# Altium project EQF1248.PrjPcb
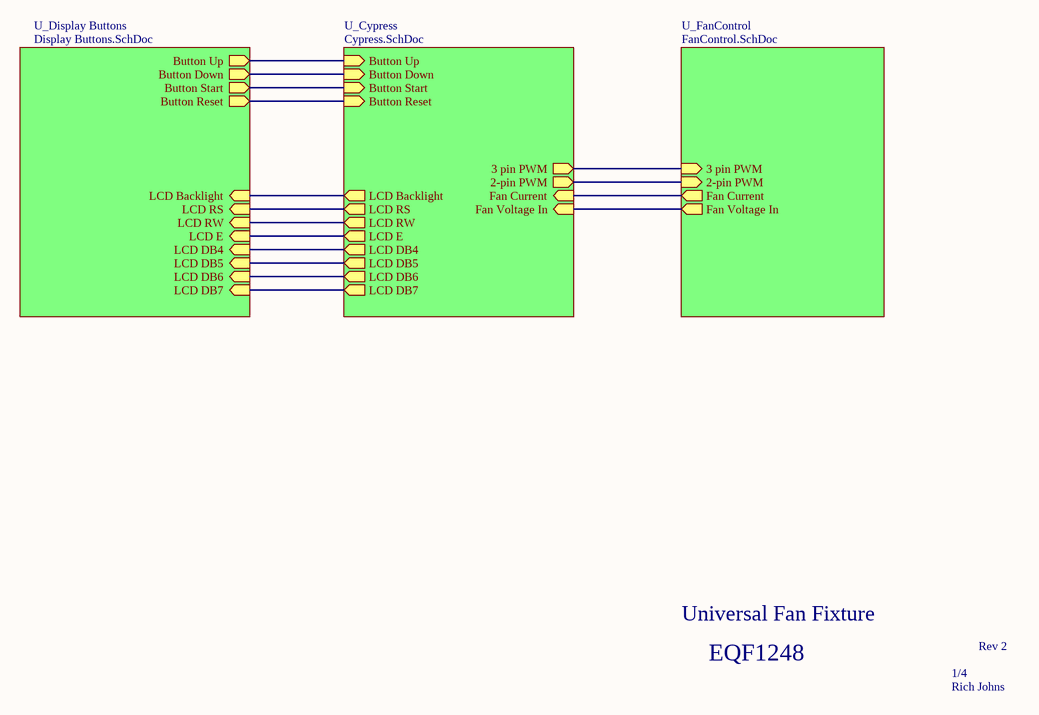
[diagram p0: Universal Fan Fixture.SchDoc]
4 sheets, 93 parts. Net scope: hierarchical (ports join the sheet entries above them; power ports are global).
Board file: EQF1248.PcbDoc
Sheets:
  Universal Fan Fixture.SchDoc
    U_Cypress = Cypress.SchDoc
    U_Display Buttons = Display Buttons.SchDoc
    U_FanControl = FanControl.SchDoc

## Sheet Universal Fan Fixture.SchDoc
size A; DocumentNumber: 1; SheetNumber: 1; SheetTotal: 4; PageSetup: Record=PageOptions|CenterHorizontal=True|CenterVertical=True|PrintScale=1.12|XCorrection=1.00|YCorrection=1.00|PrintKind=1|BorderSize=5000000|LeftOffset=0|BottomOffset=0|Orientation=2|PaperLength=2794|PaperWidth=2159|Scale=100|PaperSource=15|PrintQuality=600|MediaType=1|DitherType=10|PaperKind=Letter|PrintScaleMode=1

### Sub-sheets
U_Cypress = Cypress.SchDoc: LCD DB4 (out), LCD DB5 (out), LCD DB7 (out), LCD DB6 (out), LCD E (out), LCD RS (out), LCD RW (out), LCD Backlight (out), Button Down (in), Button Start (in), Button Up (in), Button Reset (in), 3 pin PWM (out), 2-pin PWM (out), Fan Current (in), Fan Voltage In (in)
U_Display Buttons = Display Buttons.SchDoc: Button Down (out), Button Start (out), Button Up (out), Button Reset (out), LCD Backlight (in), LCD RS (in), LCD RW (in), LCD E (in), LCD DB4 (in), LCD DB5 (in), LCD DB6 (in), LCD DB7 (in)
U_FanControl = FanControl.SchDoc: Fan Voltage In (out), Fan Current (out), 3 pin PWM (in), 2-pin PWM (in)

### Nets
NetR3_1: sheet U_Cypress/LCD RS, sheet U_Display Buttons/LCD RS
NetR4_1: sheet U_Cypress/LCD RW, sheet U_Display Buttons/LCD RW
NetR5_1: sheet U_Cypress/LCD E, sheet U_Display Buttons/LCD E
NetR6_1: sheet U_Cypress/LCD DB4, sheet U_Display Buttons/LCD DB4
NetR7_1: sheet U_Cypress/LCD DB5, sheet U_Display Buttons/LCD DB5
NetR8_1: sheet U_Cypress/LCD DB6, sheet U_Display Buttons/LCD DB6
NetR9_1: sheet U_Cypress/LCD DB7, sheet U_Display Buttons/LCD DB7
NetR11_1: sheet U_Cypress/LCD Backlight, sheet U_Display Buttons/LCD Backlight
NetR28_1: sheet U_Cypress/2-pin PWM, sheet U_FanControl/2-pin PWM
NetR30_1: sheet U_Cypress/Fan Current, sheet U_FanControl/Fan Current
NetR31_1: sheet U_Cypress/Button Reset, sheet U_Display Buttons/Button Reset
NetR32_1: sheet U_Cypress/Button Start, sheet U_Display Buttons/Button Start
NetR33_1: sheet U_Cypress/Button Down, sheet U_Display Buttons/Button Down
NetR34_1: sheet U_Cypress/Button Up, sheet U_Display Buttons/Button Up
NetU1_29: sheet U_Cypress/Fan Voltage In, sheet U_FanControl/Fan Voltage In
NetU1_30: sheet U_Cypress/3 pin PWM, sheet U_FanControl/3 pin PWM

### Notes on the sheet
- Universal Fan Fixture
- EQF1248
- 1/4
- Rev 2
- Rich Johns

## Sheet Cypress.SchDoc
size A; DocumentNumber: 2; SheetNumber: 2; SheetTotal: 4
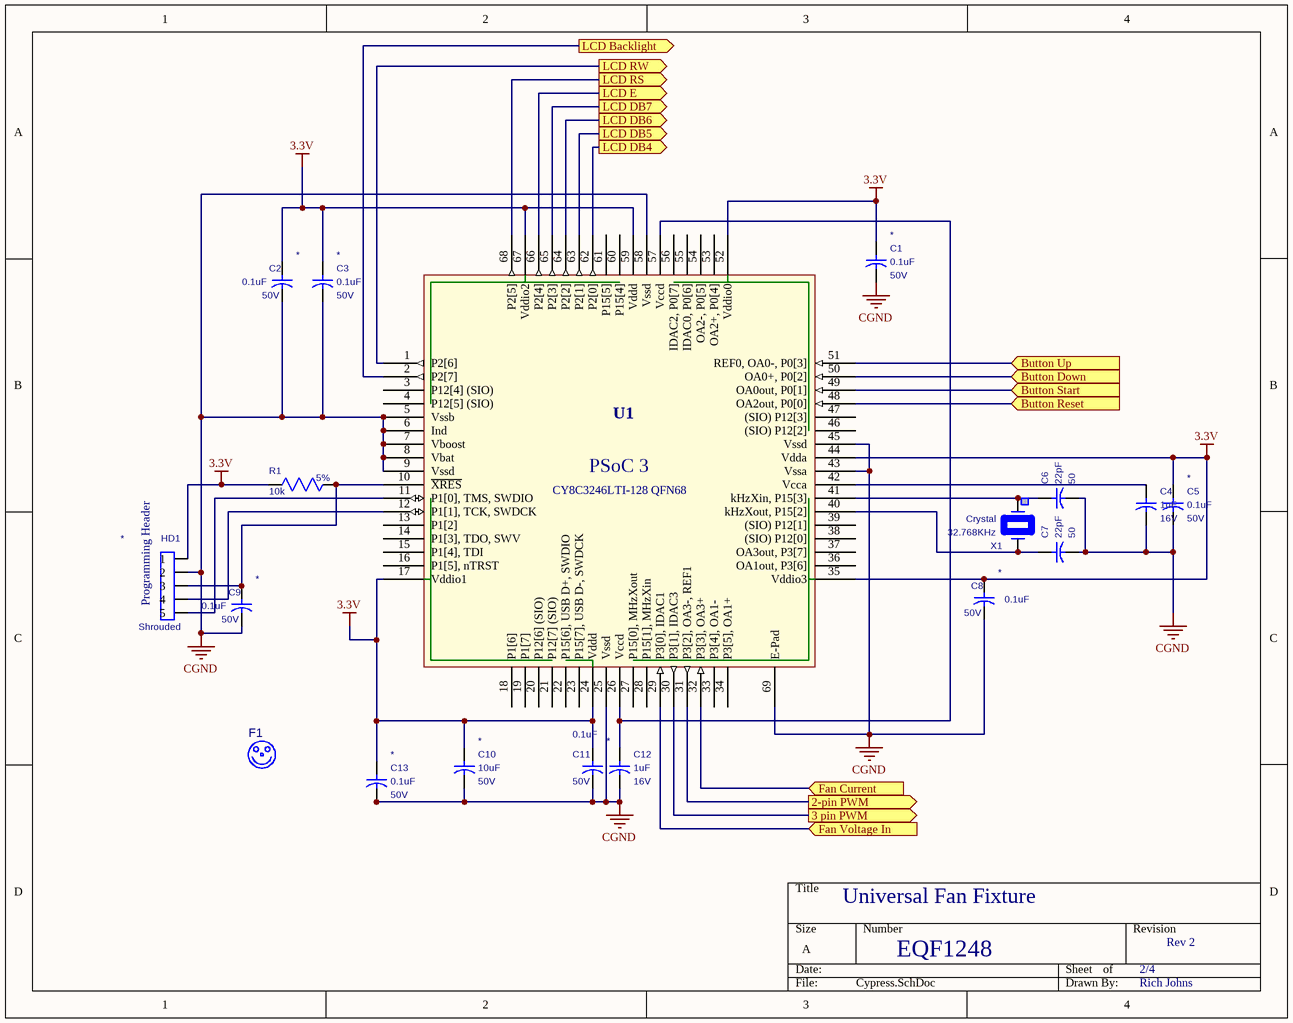
[diagram p1: Cypress.SchDoc]

### Parts
C1  value 0.1uF  Voltage: 50V  [0603]  (hidden comment: CAP_NON_POLAR_SMT)
C2  value 0.1uF  Voltage: 50V  [0603]  (hidden comment: CAP_NON_POLAR_SMT)
C3  value 0.1uF  Voltage: 50V  [0603]  (hidden comment: CAP_NON_POLAR_SMT)
C4  value 1uF  Voltage: 16V  [0603]  (hidden comment: 1.0uF_0603_16V)
C5  value 0.1uF  Voltage: 50V  [0603]  (hidden comment: CAP_NON_POLAR_SMT)
C6  value 22pF  Voltage: 50  [0603]  (hidden comment: 22pF_0603)
C7  value 22pF  Voltage: 50  [0603]  (hidden comment: 22pF_0603)
C8  value 0.1uF  Voltage: 50V  [0603]  (hidden comment: CAP_NON_POLAR_SMT)
C9  value 0.1uF  Voltage: 50V  [0603]  (hidden comment: CAP_NON_POLAR_SMT)
C10  value 10uF  Voltage: 50V  [1206]  (hidden comment: CAP_NON_POLAR_SMT)
C11  value 0.1uF  Voltage: 50V  [0603]  (hidden comment: CAP_NON_POLAR_SMT)
C12  value 1uF  Voltage: 16V  [0603]  (hidden comment: 1.0uF_0603_16V)
C13  value 0.1uF  Voltage: 50V  [0603]  (hidden comment: CAP_NON_POLAR_SMT)
F1  FIDUCIAL_SMILEY  [FIDUCIAL_SMILEY]  (value not drawn)
HD1  HeaderType: Shrouded  [HDR5PIN100SHRD]  (hidden comment: HDR5PIN100SHRD)
R1  value 10k  Tolerance: 5%  [RC0603REFLOW-IPC]  (hidden comment: R0603REFLOW_5%_1/8WATT)
U1  CY8C3246LTI-128 QFN68  [QFN68_8x8-MD]
X1  Frequency: 32.768KHz  XtalType: Crystal  [.03_Small_Footprint_CRYSTAL]  (hidden comment: 32.768KHZ_CRYSTAL)

### Ports
2-pin PWM (out), 3 pin PWM (out), Button Down (in), Button Reset (in), Button Start (in), Button Up (in), Fan Current (in), Fan Voltage In (in), LCD Backlight (out), LCD DB4 (out), LCD DB5 (out), LCD DB6 (out), LCD DB7 (out), LCD E (out), LCD RS (out), LCD RW (out)

### Nets
3.3V: C1.1(pin1) C2.1(pin1) C3.1(pin1) C5.1(pin1) C8.1(pin1) C10.1(pin1) C11.1(pin1) C13.1(pin1) HD1.1 R1.2(pin2) U1.17(Vddio1) U1.24(Vddd) U1.35(Vddio3) U1.44(Vdda) U1.52(Vddio0) U1.59(Vddd) U1.67(Vddio2)
CGND: C1.2(pin2) C2.2(pin2) C3.2(pin2) C4.2(pin2) C5.2(pin2) C6.2(pin2) C7.2(pin2) C8.2(pin2) C9.2(pin2) C10.2(pin2) C11.2(pin2) C12.2(pin2) C13.2(pin2) HD1.2 U1.5(Vssb) U1.6(Ind) U1.7(Vboost) U1.8(Vbat) U1.9(Vssd) U1.25(Vssd) U1.43(Vssa) U1.45(Vssd) U1.58(Vssd) U1.69(E-Pad)
NetC4_1: C4.1(pin1) U1.42(Vcca)
NetC6_1: C6.1(pin1) U1.41(kHzXin,_P15[3]) X1.1
NetC7_1: C7.1(pin1) U1.40(kHzXout,_P15[2]) X1.2
NetC9_1: C9.1(pin1) HD1.3 R1.1(pin1) U1.10(~{XRES})
NetC12_1: C12.1(pin1) U1.26(Vccd) U1.57(Vccd)
NetHD1_4: HD1.4 U1.12(P1[1],_TCK,_SWDCK)
NetHD1_5: HD1.5 U1.11(P1[0],_TMS,_SWDIO)
NetR3_1: U1.68(P2[5]) ; port LCD RS
NetR4_1: U1.1(P2[6]) ; port LCD RW
NetR5_1: U1.66(P2[4]) ; port LCD E
NetR6_1: U1.62(P2[0]) ; port LCD DB4
NetR7_1: U1.63(P2[1]) ; port LCD DB5
NetR8_1: U1.64(P2[2]) ; port LCD DB6
NetR9_1: U1.65(P2[3]) ; port LCD DB7
NetR11_1: U1.2(P2[7]) ; port LCD Backlight
NetR28_1: U1.31(P3[2],_OA3-,_REF1) ; port 2-pin PWM
NetR30_1: U1.32(P3[3],_OA3+) ; port Fan Current
NetR31_1: U1.48(OA2out,_P0[0]) ; port Button Reset
NetR32_1: U1.49(OA0out,_P0[1]) ; port Button Start
NetR33_1: U1.50(OA0+,_P0[2]) ; port Button Down
NetR34_1: U1.51(REF0,_OA0-,_P0[3]) ; port Button Up
NetU1_29: U1.29(P3[0],_IDAC1) ; port Fan Voltage In
NetU1_30: U1.30(P3[1],_IDAC3) ; port 3 pin PWM

Not connected (* = marked no-connect by the designer): HD1 6; U1 3(P12[4]_(SIO)) 4(P12[5]_(SIO)) 13(P1[2]) 14(P1[3],_TDO,_SWV) 15(P1[4],_TDI) 16(P1[5],_nTRST) 18(P1[6]) 19(P1[7]) 20(P12[6]_(SIO)) 21(P12[7]_(SIO)) 22(P15[6],_USB_D+,_SWDIO) 23(P15[7],_USB_D-,_SWDCK) 27(P15[0],_MHzXout) 28(P15[1],_MHzXin) 33(P3[4],_OA1-) 34(P3[5],_OA1+) 36(OA1out,_P3[6]) 37(OA3out,_P3[7]) 38((SIO)_P12[0]) 39((SIO)_P12[1]) 46((SIO)_P12[2]) 47((SIO)_P12[3]) 53(OA2+,_P0[4]) 54(OA2-,_P0[5]) 55(IDAC0,_P0[6]) 56(IDAC2,_P0[7]) 60(P15[4]) 61(P15[5])

### Notes on the sheet
- (near HD1) Programming Header
- Universal Fan Fixture
- EQF1248
- 2/4
- Rev 2
- Rich Johns
- (in symbol CY8C3xxxLTx-xxx QFN68) PSoC 3

### Library data of the parts
C1-C3 C5 C8 C9 C11 C13 = 264790: Capacitor, 0.1uF, 50V, Ceramic, X7R, +/- 20%, Non-Polar, 0603, Kemet: C0603C104M5RACTU or equivalent; plIDX: 264790; Tolerance: +/- 20%; CheckedBy: Sam Rhoufiry; DNS: *; ComponentType: Capacitor; CreatedBy: Mike Tyger; LastUpdatedBy: Mike Tyger; Cost: 0.01; Composition: Ceramic; CapType: X7R; Polarity: Non-Polar; Package: 0603; Vendor: Kemet: C0603C104M5RACTU or equivalent; ComponentLink4URL: https://pdm.iconfitness.com/PDM/EBOM/PartsMaintenance/PartsMaintenance.aspx?Editplidx=264790; ComponentLink4Description: PDM Parts Maintenance
C4 C12 = 18838: Capacitor, 1uF, 16V, Ceramic, X5R, +/- 10%, Non-Polar, 0603, 2, MURATA: GRM188R61C105KA93D OR EQUIVALENT; Tolerance: +/- 10%; plIDX: 18838; Composition: Ceramic; Package: 0603; CapType: X5R; Polarity: Non-Polar; Vendor: MURATA: GRM188R61C105KA93D OR EQUIVALENT; CheckedBy: gdeguzman; ModifyDate: 3/9/10; ComponentType: Capacitor; Supplier 1: Digi-Key; Supplier Part Number 1: 490-1536-2-ND; LastUpdatedBy: Rui Zhang; Cost: 0.001; Pins: 2; ComponentLink4URL: https://pdm.iconfitness.com/PDM/EBOM/PartsMaintenance/PartsMaintenance.aspx?Editplidx=18838; ComponentLink4Description: PDM Parts Maintenance
C6 C7 = 19574: Capacitor, 22pF, 50, Ceramic, NPO, +/-5%, Non-Polar, 0603, 2, Kemet:C0603C220J5GACTU or equivalent; plIDX: 19574; Composition: Ceramic; Package: 0603; CapType: NPO; Tolerance: +/-5%; Polarity: Non-Polar; Vendor: Kemet:C0603C220J5GACTU or equivalent; CheckedBy: gdeguzman; ModifyDate: 4/23/10; ComponentType: Capacitor; Supplier 1: Digi-Key; Supplier Part Number 1: 399-1053-2-ND; LastUpdatedBy: Michael Angeli; Cost: 0.01; Pins: 2; ComponentLink4URL: https://pdm.iconfitness.com/PDM/EBOM/PartsMaintenance/PartsMaintenance.aspx?Editplidx=19574; ComponentLink4Description: PDM Parts Maintenance
C10 = 265299: Capacitor, 10uF, 50V, Ceramic, X5R, +/- 20%, Non-Polar, 1206, Taiyo Yuden: UMK316BBJ106ML-T or equivalent; plIDX: 265299; Tolerance: +/- 20%; CheckedBy: Sam Rhoufiry; DNS: *; ComponentType: Capacitor; CreatedBy: Mike Tyger; LastUpdatedBy: Mike Tyger; Cost: 0.05; Composition: Ceramic; CapType: X5R; Polarity: Non-Polar; Package: 1206; Vendor: Taiyo Yuden: UMK316BBJ106ML-T or equivalent; ComponentLink1URL: http://www.yuden.co.jp/productdata/catalog/en/mlcc01_e.pdf; ComponentLink1Description: Datasheet; ComponentLink4URL: https://pdm.iconfitness.com/PDM/EBOM/PartsMaintenance/PartsMaintenance.aspx?Editplidx=265299; ComponentLink4Description: PDM Parts Maintenance
F1 = 264290: Fiducial, Smiley, PCB reference point, not a component; plIDX: 264290; Value: Smiley; ComponentType: Fiducial; CreatedBy: Mike Tyger; LastUpdatedBy: Michael Angeli; Cost: 0; Vendor: PCB reference point, not a component; ComponentLink4URL: https://pdm.iconfitness.com/PDM/EBOM/PartsMaintenance/PartsMaintenance.aspx?Editplidx=264290; ComponentLink4Description: PDM Parts Maintenance
HD1 = 1770: Header, 0.100 in., 5 pin Pins, Shrouded, AMP: 644486-5; IDF_COMP: 1; plIDX: 1770; LeadSpacing: 0.100 in.; Pins: 5 pin; Vendor: AMP: 644486-5; CheckedBy: Michael Angeli; Datasheet: g:\accel_lib\datasheets\MTA-AMP.pdf; ModifyDate: 07/30/2008 17:40:27; ComponentHeight: 625mil; ComponentType: Header; DNS: *; Cost: 0.08; ComponentLink4URL: https://pdm.iconfitness.com/PDM/EBOM/PartsMaintenance/PartsMaintenance.aspx?Editplidx=1770; ComponentLink4Description: PDM Parts Maintenance
R1 = 15593: Resistor, 18, ThickFilm, 5%, 0603, 1/8W, Any; plIDX: 15593; DNS: *; Wattage: 1/8W; Composition: ThickFilm; Package: 0603; Vendor: Any; CheckedBy: *; ModifyDate: 05/30/2007 09:48:36; ComponentType: Resistor; Cost: 0.001; ComponentLink4URL: https://pdm.iconfitness.com/PDM/EBOM/PartsMaintenance/PartsMaintenance.aspx?Editplidx=15593; ComponentLink4Description: PDM Parts Maintenance
U1 = CY8C3xxxLTx-xxx QFN68: CY8C3xxxLTx-xxx 68 pin QFN; MFN: Cypress Semiconductor; MFG: Cypress; MFGPN: CY8C3xxxLTx-xxx; Vendor: Cypress; VPN: CY8C3246LTI-128
X1 = 19127: Xtal, 0.7 mm, Cylinder, 2, Crystal, 32.768KHz, ECS: ECS-.327-12.5-13;Alternates require approval; LeadSpacing: 0.7 mm; plIDX: 19127; CheckedBy: Sam Rhoufiry; Package: Cylinder; Pins: 2; Vendor: ECS: ECS-.327-12.5-13;Alternates require approval; Datasheet: G:\accel_lib\datasheets\Crystal_32768KHz_ECS-3x8.pdf; ModifyDate: 4/16/10; ComponentType: Xtal; DNS: *; Cost: 0.0945; ComponentLink4URL: https://pdm.iconfitness.com/PDM/EBOM/PartsMaintenance/PartsMaintenance.aspx?Editplidx=19127; ComponentLink4Description: PDM Parts Maintenance

## Sheet Display Buttons.SchDoc
size A; DocumentNumber: 4; SheetNumber: 4; SheetTotal: 4
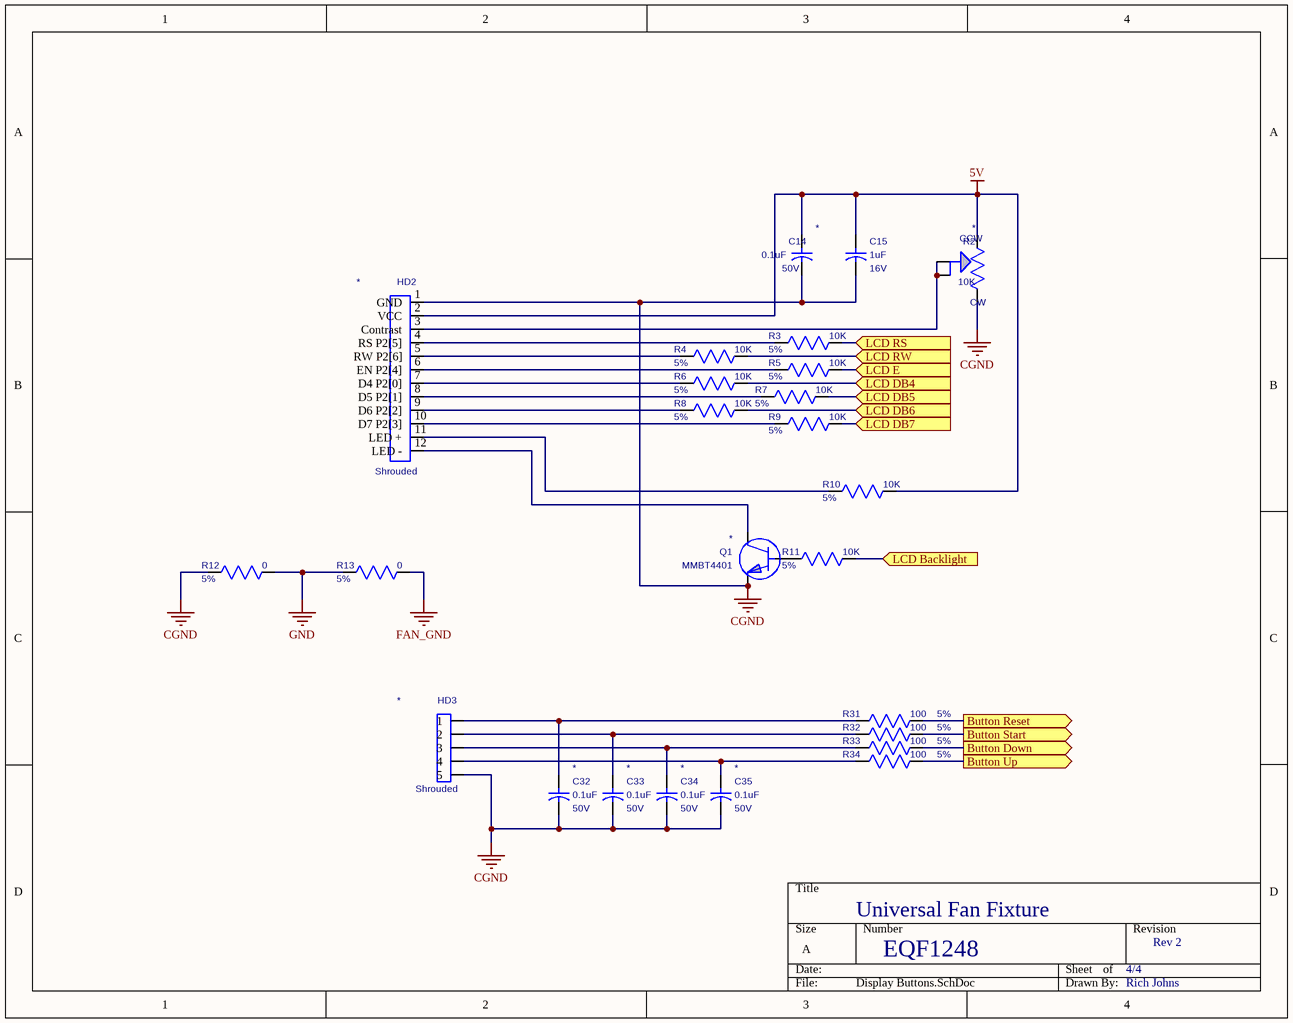
[diagram p2: Display Buttons.SchDoc]

### Parts
C14  value 0.1uF  Voltage: 50V  [0603]  (hidden comment: CAP_NON_POLAR_SMT)
C15  value 1uF  Voltage: 16V  [0603]  (hidden comment: 1.0uF_0603_16V)
C32  value 0.1uF  Voltage: 50V  [0603]  (hidden comment: CAP_NON_POLAR_SMT)
C33  value 0.1uF  Voltage: 50V  [0603]  (hidden comment: CAP_NON_POLAR_SMT)
C34  value 0.1uF  Voltage: 50V  [0603]  (hidden comment: CAP_NON_POLAR_SMT)
C35  value 0.1uF  Voltage: 50V  [0603]  (hidden comment: CAP_NON_POLAR_SMT)
HD2  HeaderType: Shrouded  [HDR12PIN100SHRD]  (hidden comment: HDR12PIN100SHRD)
HD3  HeaderType: Shrouded  [HDR5PIN100SHRD]  (hidden comment: HDR5PIN100SHRD)
Q1  value MMBT4401  [SOT23-3]  (hidden comment: NPN_TRANSISTOR)
R2  value 10K  [6MM POT]  (hidden comment: POT 6MM 10K)
R3  value 10K  Tolerance: 5%  [0603]  (hidden comment: Resistor_0603_5%)
R4  value 10K  Tolerance: 5%  [0603]  (hidden comment: Resistor_0603_5%)
R5  value 10K  Tolerance: 5%  [0603]  (hidden comment: Resistor_0603_5%)
R6  value 10K  Tolerance: 5%  [0603]  (hidden comment: Resistor_0603_5%)
R7  value 10K  Tolerance: 5%  [0603]  (hidden comment: Resistor_0603_5%)
R8  value 10K  Tolerance: 5%  [0603]  (hidden comment: Resistor_0603_5%)
R9  value 10K  Tolerance: 5%  [0603]  (hidden comment: Resistor_0603_5%)
R10  value 10K  Tolerance: 5%  [0603]  (hidden comment: Resistor_0603_5%)
R11  value 10K  Tolerance: 5%  [0603]  (hidden comment: Resistor_0603_5%)
R12  value 0  Tolerance: 5%  [0603]  (hidden comment: Resistor_0603_5%)
R13  value 0  Tolerance: 5%  [0603]  (hidden comment: Resistor_0603_5%)
R31  value 100  Tolerance: 5%  [0603]  (hidden comment: Resistor_0603_5%)
R32  value 100  Tolerance: 5%  [0603]  (hidden comment: Resistor_0603_5%)
R33  value 100  Tolerance: 5%  [0603]  (hidden comment: Resistor_0603_5%)
R34  value 100  Tolerance: 5%  [0603]  (hidden comment: Resistor_0603_5%)

### Ports
Button Down (out), Button Reset (out), Button Start (out), Button Up (out), LCD Backlight (in), LCD DB4 (in), LCD DB5 (in), LCD DB6 (in), LCD DB7 (in), LCD E (in), LCD RS (in), LCD RW (in)

### Nets
5V: C14.1(pin1) C15.1(pin1) HD2.2(VCC) R2.1 R10.1(pin1)
CGND: C14.2(pin2) C15.2(pin2) C32.2(pin2) C33.2(pin2) C34.2(pin2) C35.2(pin2) HD2.1(GND) HD3.5 Q1.2(emitter) R2.4 R12.2(pin2)
FAN_GND: R13.1(pin1)
GND: R12.1(pin1) R13.2(pin2)
NetC32_1: C32.1(pin1) HD3.1 R31.2(pin2)
NetC33_1: C33.1(pin1) HD3.2 R32.2(pin2)
NetC34_1: C34.1(pin1) HD3.3 R33.2(pin2)
NetC35_1: C35.1(pin1) HD3.4 R34.2(pin2)
NetHD2_3: HD2.3(Contrast) R2.2 R2.3
NetHD2_4: HD2.4(RS_P2[5]) R3.2(pin2)
NetHD2_5: HD2.5(RW_P2[6]) R4.2(pin2)
NetHD2_6: HD2.6(EN_P2[4]) R5.2(pin2)
NetHD2_7: HD2.7(D4_P2[0]) R6.2(pin2)
NetHD2_8: HD2.8(D5_P2[1]) R7.2(pin2)
NetHD2_9: HD2.9(D6_P2[2]) R8.2(pin2)
NetHD2_10: HD2.10(D7_P2[3]) R9.2(pin2)
NetHD2_11: HD2.11(LED_+) R10.2(pin2)
NetHD2_12: HD2.12(LED_-) Q1.3(collector)
NetQ1_1: Q1.1(base) R11.2(pin2)
NetR3_1: R3.1(pin1) ; port LCD RS
NetR4_1: R4.1(pin1) ; port LCD RW
NetR5_1: R5.1(pin1) ; port LCD E
NetR6_1: R6.1(pin1) ; port LCD DB4
NetR7_1: R7.1(pin1) ; port LCD DB5
NetR8_1: R8.1(pin1) ; port LCD DB6
NetR9_1: R9.1(pin1) ; port LCD DB7
NetR11_1: R11.1(pin1) ; port LCD Backlight
NetR31_1: R31.1(pin1) ; port Button Reset
NetR32_1: R32.1(pin1) ; port Button Start
NetR33_1: R33.1(pin1) ; port Button Down
NetR34_1: R34.1(pin1) ; port Button Up

Not connected (* = marked no-connect by the designer): HD2 13; HD3 6

### Notes on the sheet
- Universal Fan Fixture
- EQF1248
- 4/4
- Rev 2
- Rich Johns
- (in symbol 6440) CCW; CW

### Library data of the parts
C14 C32-C35 = 264790: as C1 on sheet Cypress; CheckedBy: Sam Rhoufiry; DNS: *; ComponentType: Capacitor; CreatedBy: Mike Tyger; LastUpdatedBy: Mike Tyger; Cost: 0.01; Composition: Ceramic; CapType: X7R; Polarity: Non-Polar; Package: 0603; Vendor: Kemet: C0603C104M5RACTU or equivalent; ComponentLink4URL: https://pdm.iconfitness.com/PDM/EBOM/PartsMaintenance/PartsMaintenance.aspx?Editplidx=264790; ComponentLink4Description: PDM Parts Maintenance
C15 = 18838: as C4 on sheet Cypress; Composition: Ceramic; Package: 0603; CapType: X5R; Polarity: Non-Polar; Vendor: MURATA: GRM188R61C105KA93D OR EQUIVALENT; CheckedBy: gdeguzman; ModifyDate: 3/9/10; ComponentType: Capacitor; Supplier 1: Digi-Key; Supplier Part Number 1: 490-1536-2-ND; LastUpdatedBy: Rui Zhang; Cost: 0.001; Pins: 2; ComponentLink4URL: https://pdm.iconfitness.com/PDM/EBOM/PartsMaintenance/PartsMaintenance.aspx?Editplidx=18838; ComponentLink4Description: PDM Parts Maintenance
HD2 = 1763: Header, 0.1 in., 12 pins Pins, Shrouded, AMP: 1-64486-2; LeadSpacing: 0.1 in.; PackageOutlineLayer: PackageOutline; IDF_COMP: 1; plIDX: 1763; Pins: 12 pins; Vendor: AMP: 1-64486-2; CheckedBy: Michael Angeli; Datasheet: g:\accel_lib\datasheets\MTA-AMP.pdf; ModifyDate: 07/30/2008 17:40:27; ComponentHeight: 625mil; ComponentType: Header; DNS: *; Cost: 0.24; ComponentLink4URL: https://pdm.iconfitness.com/PDM/EBOM/PartsMaintenance/PartsMaintenance.aspx?Editplidx=1763; ComponentLink4Description: PDM Parts Maintenance
HD3 = 1770: as HD1 on sheet Cypress; LeadSpacing: 0.100 in.; Pins: 5 pin; Vendor: AMP: 644486-5; CheckedBy: Michael Angeli; Datasheet: g:\accel_lib\datasheets\MTA-AMP.pdf; ModifyDate: 07/30/2008 17:40:27; ComponentHeight: 625mil; ComponentType: Header; DNS: *; Cost: 0.08; ComponentLink4URL: https://pdm.iconfitness.com/PDM/EBOM/PartsMaintenance/PartsMaintenance.aspx?Editplidx=1770; ComponentLink4Description: PDM Parts Maintenance
Q1 = 265442: Transistor, MMBT4401, 40V, SOT23-3, 500mA, NPN, Transistor, On Semi: MMBT4401LT1; plIDX: 265442; CheckedBy: gdeguzman; DNS: *; ComponentType: Transistor; CreatedBy: Mike Tyger; LastUpdatedBy: Mike Tyger; Cost: 0.0094; Voltage: 40V; Package: SOT23-3; Amperage: 500mA; TransistorType: NPN; ChipType: Transistor; Vendor: On Semi: MMBT4401LT1; ComponentLink4URL: https://pdm.iconfitness.com/PDM/EBOM/PartsMaintenance/PartsMaintenance.aspx?Editplidx=265442; ComponentLink4Description: PDM Parts Maintenance
R2 = 6440: Resistor, 10K, Carbon, 20%, 0.2 in X 0.1 in or 0.2 in X 0.2 in, 0.1W, Panasonic: EVN-D8AA03B14; plIDX: 6440; Wattage: 0.1W; Tolerance: 20%; LeadSpacing: 0.2 in X 0.1 in or 0.2 in X 0.2 in; Composition: Carbon; Vendor: Panasonic: EVN-D8AA03B14; CheckedBy: B. Lyon; DNS: *; ComponentType: Resistor; Cost: 0.001; ComponentLink4URL: https://pdm.iconfitness.com/PDM/EBOM/PartsMaintenance/PartsMaintenance.aspx?Editplidx=6440; ComponentLink4Description: PDM Parts Maintenance
R3-R11 = 18857: Resistor, 10K, ThickFilm, 5%, 0603, 1/10W, 2, Any; plIDX: 18857; Wattage: 1/10W; Composition: ThickFilm; Package: 0603; Vendor: Any; CheckedBy: Joe Diffie; ModifyDate: 3/9/10; ComponentType: Resistor; LastUpdatedBy: Rui Zhang; Cost: 0.0004; Pins: 2; ComponentLink4URL: https://pdm.iconfitness.com/PDM/EBOM/PartsMaintenance/PartsMaintenance.aspx?Editplidx=18857; ComponentLink4Description: PDM Parts Maintenance
R12 R13 = 18844: Resistor, 0, ThickFilm, 5%, 0603, 1/10W, 2, Any; plIDX: 18844; Wattage: 1/10W; Composition: ThickFilm; Package: 0603; Vendor: Any; CheckedBy: Joe Diffie; ModifyDate: 3/9/10; ComponentType: Resistor; LastUpdatedBy: Rui Zhang; Cost: 0.0004; Pins: 2; ComponentLink4URL: https://pdm.iconfitness.com/PDM/EBOM/PartsMaintenance/PartsMaintenance.aspx?Editplidx=18844; ComponentLink4Description: PDM Parts Maintenance
R31-R34 = 18852: Resistor, 100, ThickFilm, 5%, 0603, 1/10W, 2, Any; plIDX: 18852; Wattage: 1/10W; Composition: ThickFilm; Package: 0603; Vendor: Any; CheckedBy: Joe Diffie; ModifyDate: 3/9/10; ComponentType: Resistor; LastUpdatedBy: Michael Angeli; Cost: 0.0004; Pins: 2; ComponentLink4URL: https://pdm.iconfitness.com/PDM/EBOM/PartsMaintenance/PartsMaintenance.aspx?Editplidx=18852; ComponentLink4Description: PDM Parts Maintenance

## Sheet FanControl.SchDoc
size A; DocumentNumber: 3; SheetNumber: 3; SheetTotal: 4
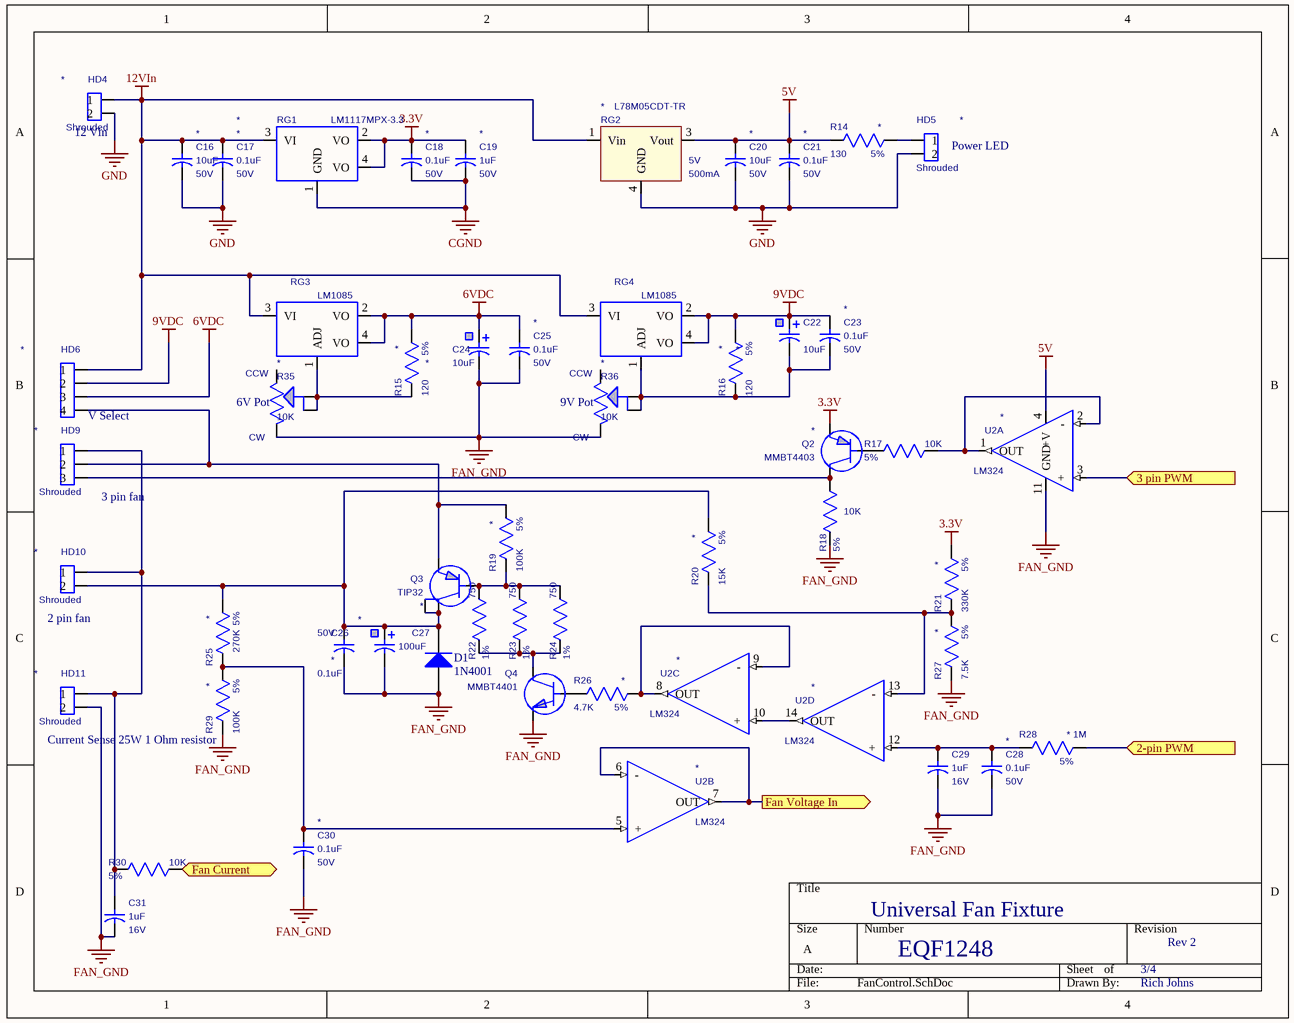
[diagram p3: FanControl.SchDoc]

### Parts
C16  value 10uF  Voltage: 50V  [1206]  (hidden comment: CAP_NON_POLAR_SMT)
C17  value 0.1uF  Voltage: 50V  [0603]  (hidden comment: CAP_NON_POLAR_SMT)
C18  value 0.1uF  Voltage: 50V  [0603]  (hidden comment: CAP_NON_POLAR_SMT)
C19  value 1uF  Voltage: 50V  [1812]  (hidden comment: CAP_NON_POLAR_SMT)
C20  value 10uF  Voltage: 50V  [1206]  (hidden comment: CAP_NON_POLAR_SMT)
C21  value 0.1uF  Voltage: 50V  [0603]  (hidden comment: CAP_NON_POLAR_SMT)
C22  value 10uF  [EIA3216-18]  (hidden comment: 10UF_TANT_16V)
C23  value 0.1uF  Voltage: 50V  [0603]  (hidden comment: CAP_NON_POLAR_SMT)
C24  value 10uF  [EIA3216-18]  (hidden comment: 10UF_TANT_16V)
C25  value 0.1uF  Voltage: 50V  [0603]  (hidden comment: CAP_NON_POLAR_SMT)
C26  value 100uF  [CAP_100RP42]  (hidden comment: 100UF_RP_35V_100)
C27  value 0.1uF  Voltage: 50V  [0603]  (hidden comment: CAP_NON_POLAR_SMT)
C28  value 0.1uF  Voltage: 50V  [0603]  (hidden comment: CAP_NON_POLAR_SMT)
C29  value 1uF  Voltage: 16V  [0603]  (hidden comment: 1.0uF_0603_16V)
C30  value 0.1uF  Voltage: 50V  [0603]  (hidden comment: CAP_NON_POLAR_SMT)
C31  value 1uF  Voltage: 16V  [0603]  (hidden comment: 1.0uF_0603_16V)
D1  1N4001  [DSO-C2/X3.3]
HD4  HeaderType: Shrouded  [HDR2PIN100SHRD]  (hidden comment: HDR2PIN100SHRD)
HD5  HeaderType: Shrouded  [HDR2PIN100SHRD]  (hidden comment: HDR2PIN100SHRD)
HD6  HDR4PIN100SHRD  [HDR4PIN100SHRD]  (value not drawn)
HD9  HeaderType: Shrouded  [HDR3PIN100SHRD]  (hidden comment: HDR3PIN100SHRD)
HD10  HeaderType: Shrouded  [HDR2PIN100SHRD]  (hidden comment: HDR2PIN100SHRD)
HD11  HeaderType: Shrouded  [HDR2PIN100SHRD]  (hidden comment: HDR2PIN100SHRD)
Q2  value MMBT4403  [SOT23-3]  (hidden comment: PNP_TRANSISTOR)
Q3  TIP32  [TO-220-NORMAL]
Q4  value MMBT4401  [SOT23-3]  (hidden comment: 2N4401_SOT23)
R14  value 130  Tolerance: 5%  [RC0603REFLOW-IPC]  (hidden comment: R0603REFLOW_5%)
R15  value 120  Tolerance: 5%  [RC0603REFLOW-IPC]  (hidden comment: R0603REFLOW_5%)
R16  value 120  Tolerance: 5%  [RC0603REFLOW-IPC]  (hidden comment: R0603REFLOW_5%)
R17  value 10K  Tolerance: 5%  [0603]  (hidden comment: Resistor_0603_5%)
R18  value 10K  Tolerance: 5%  [0603]  (hidden comment: Resistor_0603_5%)
R19  value 100K  Tolerance: 5%  [RC0603REFLOW-IPC]  (hidden comment: R0603REFLOW_5%)
R20  value 15K  Tolerance: 5%  [RC0603REFLOW-IPC]  (hidden comment: R0603REFLOW_5%)
R21  value 330K  Tolerance: 5%  [RC0603REFLOW-IPC]  (hidden comment: R0603REFLOW_5%)
R22  value 750  Tolerance: 1%  [0603]  (hidden comment: Resistor_0603_1%)
R23  value 750  Tolerance: 1%  [0603]  (hidden comment: Resistor_0603_1%)
R24  value 750  Tolerance: 1%  [0603]  (hidden comment: Resistor_0603_1%)
R25  value 270K  Tolerance: 5%  [RC0603REFLOW-IPC]  (hidden comment: R0603REFLOW_5%)
R26  value 4.7K  Tolerance: 5%  [RC0603REFLOW-IPC]  (hidden comment: R0603REFLOW_5%)
R27  value 7.5K  Tolerance: 5%  [RC0603REFLOW-IPC]  (hidden comment: R0603REFLOW_5%)
R28  value 1M  Tolerance: 5%  [RC0603REFLOW-IPC]  (hidden comment: R0603REFLOW_5%)
R29  value 100K  Tolerance: 5%  [RC0603REFLOW-IPC]  (hidden comment: R0603REFLOW_5%)
R30  value 10K  Tolerance: 5%  [0603]  (hidden comment: Resistor_0603_5%)
R35  value 10K  [6MM POT]  (hidden comment: POT 6MM 10K)
R36  value 10K  [6MM POT]  (hidden comment: POT 6MM 10K)
RG1  value LM1117MPX-3.3  [SOT-223]  (hidden comment: LM1117SPX-3.3_SOT223)
RG2  value L78M05CDT-TR  Voltage: 5V  Amperage: 500mA  [DPAK]  (hidden comment: REGULATOR_DPAK)
RG3  value LM1085  [TO-220-NORMAL]  (hidden comment: LM1085_TO220)
RG4  value LM1085  [TO-220-NORMAL]  (hidden comment: LM1085_TO220)
U2  value LM324  [SOIC14REFLOW-IPC]  (hidden comment: LM324_SOIC14)  (parts A,B,C,D of 4)

### Ports
2-pin PWM (in), 3 pin PWM (in), Fan Current (out), Fan Voltage In (out)

### Nets
3.3V: C18.1(pin1) C19.1(pin1) Q2.2(emitter) R21.1(pin1) RG1.2(VO) RG1.4(VO)
5V: C20.1(pin1) C21.1(pin1) R14.2(pin2) RG2.3(Vout) U2.4(+V)
6VDC: C24.1(+) C25.1(pin1) HD6.3 R15.1(pin1) RG3.2(VO) RG3.4(VO)
9VDC: C22.1(+) C23.1(pin1) HD6.2 R16.1(pin1) RG4.2(VO) RG4.4(VO)
12VIn: C16.1(pin1) C17.1(pin1) HD4.1 HD6.1 RG1.3(VI) RG2.1(Vin) RG3.3(VI) RG4.3(VI)
CGND: C18.2(pin2) C19.2(pin2) RG1.1(GND)
FAN_GND: C24.2(-) C25.2(pin2) C26.2(pin2) C27.2(pin2) C28.2(pin2) C29.2(pin2) C30.2(pin2) C31.2(pin2) D1.1(A) HD11.2 Q4.2(emitter) R18.2(pin2) R27.2(pin2) R29.2(pin2) R35.4 R36.4 U2.11(GND)
GND: C16.2(pin2) C17.2(pin2) C20.2(pin2) C21.2(pin2) HD4.2 HD5.2 RG2.4(GND)
NetC22_2: C22.2(-) C23.2(pin2) R16.2(pin2) R36.2 R36.3 RG4.1(ADJ)
NetC26_1: C26.1(pin1) C27.1(pin1) D1.2(K) HD10.2 Q3.2(C) Q3.4(C) R20.1(pin1) R25.1(pin1)
NetC28_1: C28.1(pin1) C29.1(pin1) R28.2(pin2) U2.12(+)
NetC30_1: C30.1(pin1) R25.2(pin2) R29.1(pin1) U2.5(+)
NetC31_1: C31.1(pin1) HD9.1 HD10.1 HD11.1 R30.2(pin2)
NetHD5_1: HD5.1 R14.1(pin1)
NetHD6_4: HD6.4 HD9.2 Q3.3(E) R19.1(pin1)
NetHD9_3: HD9.3 Q2.3(collector) R18.1(pin1)
NetQ2_1: Q2.1(base) R17.2(pin2)
NetQ3_1: Q3.1(B) R19.2(pin2) R22.1(pin1) R23.1(pin1) R24.1(pin1)
NetQ4_1: Q4.1(base) R26.2(pin2)
NetQ4_3: Q4.3(collector) R22.2(pin2) R23.2(pin2) R24.2(pin2)
NetR15_2: R15.2(pin2) R35.2 R35.3 RG3.1(ADJ)
NetR17_1: R17.1(pin1) U2.1(OUT) U2.2(-)
NetR20_2: R20.2(pin2) R21.2(pin2) R27.1(pin1) U2.13(-)
NetR26_1: R26.1(pin1) U2.8(OUT) U2.9(-)
NetR28_1: R28.1(pin1) ; port 2-pin PWM
NetR30_1: R30.1(pin1) ; port Fan Current
NetU1_29: U2.6(-) U2.7(OUT) ; port Fan Voltage In
NetU1_30: U2.3(+) ; port 3 pin PWM
NetU2_10: U2.10(+) U2.14(OUT)

Not connected (* = marked no-connect by the designer): HD4 3; HD5 3; HD6 5; HD9 4; HD10 3; HD11 3; R35 1; R36 1; RG2 2(GND)

### Notes on the sheet
- (near HD4) 12 Vin
- (near HD5) Power LED
- (near HD6) V Select
- (near R35) 6V Pot
- (near R36) 9V Pot
- (near HD9) 3 pin fan
- (near HD10) 2 pin fan
- (near R29) Current Sense 25W 1 Ohm resistor
- Universal Fan Fixture
- EQF1248
- 3/4
- Rev 2
- Rich Johns
- (in symbol 6440) CCW; CW

### Library data of the parts
C16 C20 = 265299: as C10 on sheet Cypress; CheckedBy: Sam Rhoufiry; DNS: *; ComponentType: Capacitor; CreatedBy: Mike Tyger; LastUpdatedBy: Mike Tyger; Cost: 0.05; Composition: Ceramic; CapType: X5R; Polarity: Non-Polar; Package: 1206; Vendor: Taiyo Yuden: UMK316BBJ106ML-T or equivalent; ComponentLink1URL: http://www.yuden.co.jp/productdata/catalog/en/mlcc01_e.pdf; ComponentLink1Description: Datasheet; ComponentLink4URL: https://pdm.iconfitness.com/PDM/EBOM/PartsMaintenance/PartsMaintenance.aspx?Editplidx=265299; ComponentLink4Description: PDM Parts Maintenance
C17 C18 C21 C23 C25 C27 C28 C30 = 264790: as C1 on sheet Cypress; CheckedBy: Sam Rhoufiry; DNS: *; ComponentType: Capacitor; CreatedBy: Mike Tyger; LastUpdatedBy: Mike Tyger; Cost: 0.01; Composition: Ceramic; CapType: X7R; Polarity: Non-Polar; Package: 0603; Vendor: Kemet: C0603C104M5RACTU or equivalent; ComponentLink4URL: https://pdm.iconfitness.com/PDM/EBOM/PartsMaintenance/PartsMaintenance.aspx?Editplidx=264790; ComponentLink4Description: PDM Parts Maintenance
C19 = 265012: Capacitor, 1uF, 50V, Ceramic, Z5U, +/- 20%, Non-Polar, 1812, Kemet: C1812C105M5UACTU or equivalent; plIDX: 265012; Tolerance: +/- 20%; CheckedBy: Sam Rhoufiry; DNS: *; ComponentType: Capacitor; CreatedBy: Mike Tyger; LastUpdatedBy: Mike Tyger; Cost: 0; Composition: Ceramic; CapType: Z5U; Polarity: Non-Polar; Package: 1812; Vendor: Kemet: C1812C105M5UACTU or equivalent; ComponentLink4URL: https://pdm.iconfitness.com/PDM/EBOM/PartsMaintenance/PartsMaintenance.aspx?Editplidx=265012; ComponentLink4Description: PDM Parts Maintenance
C22 C24 = 10669: Capacitor, 10uF, 16V, Tantalum, General Purpose, +/- 20%, Polar, EIA 3216-18, KEMET: T491A106M016AS or Exact Equivalent; Tolerance: +/- 20%; plIDX: 10669; Voltage: 16V; Composition: Tantalum; Package: EIA 3216-18; CapType: General Purpose; Polarity: Polar; Vendor: KEMET: T491A106M016AS or Exact Equivalent; CheckedBy: B. Lyon; Datasheet: G:\accel_lib\datasheets\T491-Kemet.pdf; ModifyDate: 01/05/2007 12:29:47; HelpURL: G:\accel_lib\datasheets\T491-Kemet.pdf; ComponentType: Capacitor; DNS: *; Cost: 0.051; ComponentLink4URL: https://pdm.iconfitness.com/PDM/EBOM/PartsMaintenance/PartsMaintenance.aspx?Editplidx=10669; ComponentLink4Description: PDM Parts Maintenance
C26 = 3428: Capacitor, 100uF, 35V, Electrolytic, +/- 20%, Radial, Polar, 0.1 in., Nichicon: UVR1V101MED or Equivalent; LeadSpacing: 0.1 in.; Tolerance: +/- 20%; PackageOutlineLayer: PackageOutline; IDF_COMP: 1; plIDX: 3428; DNS: *; Voltage: 35V; Composition: Electrolytic; Leads: Radial; Polarity: Polar; Vendor: Nichicon: UVR1V101MED or Equivalent; CheckedBy: A. Tyger; ModifyDate: 04/06/2006 14:59:49; Datasheet: G:\accel_lib\datasheets\Nichicon-VRSerisAlumElecRadialCap.pdf; ComponentHeight: 475mil; HelpURL: G:\accel_lib\datasheets\Nichicon-VRSerisAlumElecRadialCap.pdf; ComponentType: Capacitor; Cost: 0.05; ComponentLink4URL: https://pdm.iconfitness.com/PDM/EBOM/PartsMaintenance/PartsMaintenance.aspx?Editplidx=3428; ComponentLink4Description: PDM Parts Maintenance
C29 C31 = 18838: as C4 on sheet Cypress; Composition: Ceramic; Package: 0603; CapType: X5R; Polarity: Non-Polar; Vendor: MURATA: GRM188R61C105KA93D OR EQUIVALENT; CheckedBy: gdeguzman; ModifyDate: 3/9/10; ComponentType: Capacitor; Supplier 1: Digi-Key; Supplier Part Number 1: 490-1536-2-ND; LastUpdatedBy: Rui Zhang; Cost: 0.001; Pins: 2; ComponentLink4URL: https://pdm.iconfitness.com/PDM/EBOM/PartsMaintenance/PartsMaintenance.aspx?Editplidx=18838; ComponentLink4Description: PDM Parts Maintenance
D1 = Diode: Default Diode; Published: 8-Jun-2000; LatestRevisionDate: 17-Jul-2002; LatestRevisionNote: Re-released for DXP Platform.; PackageVersion: Sep-1996; PackageReference: SMC; Publisher: Altium Limited; Code_JEDEC: DO-214-AB
HD4 HD5 HD10 HD11 = 1766: Header, 0.100 in., 2 Pins, Shrouded, AMP: 644486-2; PackageOutlineLayer: PackageOutline; IDF_COMP: 1; plIDX: 1766; LeadSpacing: 0.100 in.; Pins: 2; Vendor: AMP: 644486-2; CheckedBy: *; Datasheet: g:\accel_lib\datasheets\MTA-AMP.pdf; ModifyDate: 07/30/2008 17:40:27; ComponentHeight: 625mil; ComponentType: Header; DNS: *; LastUpdatedBy: Mike Tyger; Cost: 0.042; ComponentLink4URL: https://pdm.iconfitness.com/PDM/EBOM/PartsMaintenance/PartsMaintenance.aspx?Editplidx=1766; ComponentLink4Description: PDM Parts Maintenance
HD6 = 1768: Header, 0.100 in., 4 pin Pins, Shrouded, AMP: 644486-4; IDF_COMP: 1; Reference: g:\accel_lib\datasheets\MTA-AMP.pdf; plIDX: 1768; LeadSpacing: 0.100 in.; Pins: 4 pin; HeaderType: Shrouded; Vendor: AMP: 644486-4; CheckedBy: Michael Angeli; Datasheet: G:\accel_lib\datasheets\644486-AMP-header.pdf; ComponentHeight: 625mil; ModifyDate: 07/30/2008 17:40:28; ComponentType: Header; DNS: *; Cost: 0.07; ComponentLink4URL: https://pdm.iconfitness.com/PDM/EBOM/PartsMaintenance/PartsMaintenance.aspx?Editplidx=1768; ComponentLink4Description: PDM Parts Maintenance
HD9 = 1767: Header, 0.100 in., 3 pin Pins, Shrouded, AMP: 644486-3; PackageOutlineLayer: PackageOutline; IDF_COMP: 1; plIDX: 1767; LeadSpacing: 0.100 in.; Pins: 3 pin; Vendor: AMP: 644486-3; CheckedBy: Grunt Mcfunkwhistle; Datasheet: g:\accel_lib\datasheets\MTA-AMP.pdf; ModifyDate: 10/23/2008 15:32:40; ComponentHeight: 625mil; ComponentType: Header; DNS: *; Cost: 0.055; ComponentLink4URL: https://pdm.iconfitness.com/PDM/EBOM/PartsMaintenance/PartsMaintenance.aspx?Editplidx=1767; ComponentLink4Description: PDM Parts Maintenance
Q2 = 18850: Transistor, MMBT4403, 40V, SOT23-3, PNP, Transistor, On Semi: MMBT4403LT1; plIDX: 18850; CheckedBy: gdeguzman; DNS: *; ComponentType: Transistor; LastUpdatedBy: Mike Tyger; Cost: 0.0124; Voltage: 40V; Package: SOT23-3; TransistorType: PNP; ChipType: Transistor; Vendor: On Semi: MMBT4403LT1; ComponentLink4URL: https://pdm.iconfitness.com/PDM/EBOM/PartsMaintenance/PartsMaintenance.aspx?Editplidx=18850; ComponentLink4Description: PDM Parts Maintenance
Q3 = 2637: Transistor, TIP32, 40V, TO-220, 3A, PNP, Any; plIDX: 2637; Voltage: 40V; Package: TO-220; Amperage: 3A; TransistorType: PNP; CheckedBy: B. Lyon; Datasheet: g:\accel_lib\datasheets\TIP32-Fairchild.pdf; Vendor: Any; ModifyDate: 08/27/2007 16:01:42; HelpURL: g:\accel_lib\datasheets\TIP32-Fairchild.pdf; ComponentType: Transistor; DNS: *; Value: TIP32; Cost: 0.125; ComponentLink4URL: https://pdm.iconfitness.com/PDM/EBOM/PartsMaintenance/PartsMaintenance.aspx?Editplidx=2637; ComponentLink4Description: PDM Parts Maintenance
Q4 = 18848: Transistor, MMBT4401, 40V, SOT23, 500mA, 3, NPN, Transistor, On Semi: MMBT4401LT1; plIDX: 18848; Package: SOT23; Voltage: 40V; Amperage: 500mA; TransistorType: NPN; Vendor: On Semi: MMBT4401LT1; CheckedBy: gdeguzman; ModifyDate: 3/9/10; ChipType: Transistor; ComponentType: Transistor; Supplier 1: Digi-Key; Supplier Part Number 1: MMBT4401-FDITR-ND; LastUpdatedBy: Mike Tyger; Cost: 0.0124; Pins: 3; ComponentLink4URL: https://pdm.iconfitness.com/PDM/EBOM/PartsMaintenance/PartsMaintenance.aspx?Editplidx=18848; ComponentLink4Description: PDM Parts Maintenance
R14 = 2403: Resistor, 130, ThickFilm, 5%, 0603, 1/10W, Any; Notes: .; plIDX: 2403; Wattage: 1/10W; Composition: ThickFilm; Package: 0603; Vendor: Any; CheckedBy: Michael Angeli; ModifyDate: 03/02/2004 17:13:13; ComponentType: Resistor; DNS: *; Cost: 0.001; ComponentLink4URL: https://pdm.iconfitness.com/PDM/EBOM/PartsMaintenance/PartsMaintenance.aspx?Editplidx=2403; ComponentLink4Description: PDM Parts Maintenance
R15 R16 = 5495: Resistor, 120, ThickFilm, 5%, 0603, 1/10W, Any; Notes: .; plIDX: 5495; Wattage: 1/10W; Composition: ThickFilm; Package: 0603; Vendor: Any; CheckedBy: Michael Angeli; ModifyDate: 03/02/2004 17:13:13; ComponentType: Resistor; DNS: *; Cost: 0.001; ComponentLink4URL: https://pdm.iconfitness.com/PDM/EBOM/PartsMaintenance/PartsMaintenance.aspx?Editplidx=5495; ComponentLink4Description: PDM Parts Maintenance
R17 R18 R30 = 18857: as R3 on sheet Display Buttons; Wattage: 1/10W; Composition: ThickFilm; Package: 0603; Vendor: Any; CheckedBy: Joe Diffie; ModifyDate: 3/9/10; ComponentType: Resistor; LastUpdatedBy: Rui Zhang; Cost: 0.0004; Pins: 2; ComponentLink4URL: https://pdm.iconfitness.com/PDM/EBOM/PartsMaintenance/PartsMaintenance.aspx?Editplidx=18857; ComponentLink4Description: PDM Parts Maintenance
R19 R29 = 2046: Resistor, 100K, ThickFilm, 5%, 0603, 1/10W, Any; Notes: .; plIDX: 2046; Wattage: 1/10W; Composition: ThickFilm; Package: 0603; Vendor: Any; CheckedBy: Michael Angeli; ModifyDate: 03/02/2004 17:13:13; ComponentType: Resistor; DNS: *; Cost: 0.001; ComponentLink4URL: https://pdm.iconfitness.com/PDM/EBOM/PartsMaintenance/PartsMaintenance.aspx?Editplidx=2046; ComponentLink4Description: PDM Parts Maintenance
R20 = 2157: Resistor, 15K, ThickFilm, 5%, 0603, 1/10W, Any; Notes: .; plIDX: 2157; Wattage: 1/10W; Composition: ThickFilm; Package: 0603; Vendor: Any; CheckedBy: Michael Angeli; ModifyDate: 03/02/2004 17:13:13; ComponentType: Resistor; DNS: *; Cost: 0.001; ComponentLink4URL: https://pdm.iconfitness.com/PDM/EBOM/PartsMaintenance/PartsMaintenance.aspx?Editplidx=2157; ComponentLink4Description: PDM Parts Maintenance
R21 = 5186: Resistor, 330K, ThickFilm, 5%, 0603, 1/10W, Any; Notes: .; plIDX: 5186; Wattage: 1/10W; Composition: ThickFilm; Package: 0603; Vendor: Any; CheckedBy: Michael Angeli; ModifyDate: 03/02/2004 17:13:13; ComponentType: Resistor; DNS: *; Cost: 0.001; ComponentLink4URL: https://pdm.iconfitness.com/PDM/EBOM/PartsMaintenance/PartsMaintenance.aspx?Editplidx=5186; ComponentLink4Description: PDM Parts Maintenance
R22-R24 = 20273: Resistor, 750, 1%, 0603, 1/10W, 2, Any; plIDX: 20273; Wattage: 1/10W; Package: 0603; Vendor: Any; CheckedBy: gdeguzman; ComponentLink1Description: Datasheet; ComponentLink1URL: \\iconfitness.com\loganfiles\RND Departments\Electronics\accel_lib\Datasheets\1210_1%_resistor.pdf; ComponentType: Resistor; LastUpdatedBy: Ben Hill; Cost: 0.0006; Pins: 2; ComponentLink4URL: https://pdm.iconfitness.com/PDM/EBOM/PartsMaintenance/PartsMaintenance.aspx?Editplidx=20273; ComponentLink4Description: PDM Parts Maintenance
R25 = 14583: Resistor, 270K, ThickFilm, 5%, 0603, 1/10W, Any; Notes: .; plIDX: 14583; Wattage: 1/10W; Composition: ThickFilm; Package: 0603; Vendor: Any; CheckedBy: Michael Angeli; ModifyDate: 03/02/2004 17:13:13; ComponentType: Resistor; DNS: *; Cost: 0.001; ComponentLink4URL: https://pdm.iconfitness.com/PDM/EBOM/PartsMaintenance/PartsMaintenance.aspx?Editplidx=14583; ComponentLink4Description: PDM Parts Maintenance
R26 = 2071: Resistor, 4.7K, ThickFilm, 5%, 0603, 1/10W, Any; Notes: .; plIDX: 2071; Wattage: 1/10W; Composition: ThickFilm; Package: 0603; Vendor: Any; CheckedBy: Michael Angeli; ModifyDate: 03/02/2004 17:13:13; ComponentType: Resistor; DNS: *; Cost: 0.001; ComponentLink4URL: https://pdm.iconfitness.com/PDM/EBOM/PartsMaintenance/PartsMaintenance.aspx?Editplidx=2071; ComponentLink4Description: PDM Parts Maintenance
R27 = 6345: Resistor, 7.5K, ThickFilm, 5%, 0603, 1/10W, Any; Notes: .; plIDX: 6345; Wattage: 1/10W; Composition: ThickFilm; Package: 0603; Vendor: Any; CheckedBy: Michael Angeli; ModifyDate: 03/02/2004 17:13:13; ComponentType: Resistor; DNS: *; Cost: 0.001; ComponentLink4URL: https://pdm.iconfitness.com/PDM/EBOM/PartsMaintenance/PartsMaintenance.aspx?Editplidx=6345; ComponentLink4Description: PDM Parts Maintenance
R28 = 2052: Resistor, 1M, ThickFilm, 5%, 0603, 1/10W, Any; Notes: .; plIDX: 2052; Wattage: 1/10W; Composition: ThickFilm; Package: 0603; Vendor: Any; CheckedBy: Michael Angeli; ModifyDate: 03/02/2004 17:13:13; ComponentType: Resistor; DNS: *; Cost: 0.001; ComponentLink4URL: https://pdm.iconfitness.com/PDM/EBOM/PartsMaintenance/PartsMaintenance.aspx?Editplidx=2052; ComponentLink4Description: PDM Parts Maintenance
R35 R36 = 6440: as R2 on sheet Display Buttons; Wattage: 0.1W; Tolerance: 20%; LeadSpacing: 0.2 in X 0.1 in or 0.2 in X 0.2 in; Composition: Carbon; Vendor: Panasonic: EVN-D8AA03B14; CheckedBy: B. Lyon; DNS: *; ComponentType: Resistor; Cost: 0.001; ComponentLink4URL: https://pdm.iconfitness.com/PDM/EBOM/PartsMaintenance/PartsMaintenance.aspx?Editplidx=6440; ComponentLink4Description: PDM Parts Maintenance
RG1 = 18870: Regulator, LM1117MPX-3.3, 3.3V, SOT223, 800mA, 4, LDO, National: LM117MPX-3.3; plIDX: 18870; Voltage: 3.3V; Package: SOT223; Amperage: 800mA; RegulatorType: LDO; Vendor: National: LM117MPX-3.3; CheckedBy: gdeguzman; ModifyDate: 3/15/10; ComponentType: Regulator; Supplier 1: Digi-Key; Supplier Part Number 1: LM1117MPX-3.3TR-ND; DNS: *; LastUpdatedBy: Rui Zhang; Cost: 0.2; Pins: 4; ComponentLink4URL: https://pdm.iconfitness.com/PDM/EBOM/PartsMaintenance/PartsMaintenance.aspx?Editplidx=18870; ComponentLink4Description: PDM Parts Maintenance
RG2 = 265303: Regulator, L78M05CDT-TR, 5V, DPAK, 500mA, Linear, ST: L78M05CDT-TR or equivalent; plIDX: 265303; CheckedBy: B. Lyon; DNS: *; ComponentType: Regulator; CreatedBy: Mike Tyger; LastUpdatedBy: Mike Tyger; Cost: 0.05; Package: DPAK; RegulatorType: Linear; Vendor: ST: L78M05CDT-TR or equivalent; ComponentLink4URL: https://pdm.iconfitness.com/PDM/EBOM/PartsMaintenance/PartsMaintenance.aspx?Editplidx=265303; ComponentLink4Description: PDM Parts Maintenance
RG3 RG4 = 283929: Regulator, LM1085, Adjustable, TO-220, 3A, LDO, Texas Instruments; plIDX: 283929; ComponentType: Regulator; CreatedBy: Rui Zhang; LastUpdatedBy: Rui Zhang; Cost: 0; Voltage: Adjustable; Package: TO-220; Amperage: 3A; RegulatorType: LDO; Vendor: Texas Instruments; ComponentLink4URL: https://pdm.iconfitness.com/PDM/EBOM/PartsMaintenance/PartsMaintenance.aspx?Editplidx=283929; ComponentLink4Description: PDM Parts Maintenance
U2 = 1795: IC, LM324, SOIC, 14 pin, Op-Amp, National Semiconductor; IDF_COMP: 1; PackageOutlineLayer: PackageOutline; plIDX: 1795; Package: SOIC; Pins: 14 pin; ChipType: Op-Amp; Datasheet: g:\accel_lib\datasheets\LM324-national.pdf; CheckedBy: B. Lyon; ComponentHeight: 70mil; ModifyDate: 05/19/2006 16:03:59; HelpURL: g:\accel_lib\datasheets\LM324-national.pdf; ComponentType: IC; DNS: *; Cost: 0.0602; Vendor: National Semiconductor; ComponentLink4URL: https://pdm.iconfitness.com/PDM/EBOM/PartsMaintenance/PartsMaintenance.aspx?Editplidx=1795; ComponentLink4Description: PDM Parts Maintenance

## Nets that join several sheets
3.3V: Cypress (17 pins), FanControl (6 pins)
5V: Display Buttons (5 pins), FanControl (5 pins)
CGND: Cypress (24 pins), Display Buttons (11 pins), FanControl (C18.2 C19.2 RG1.1)
FAN_GND: Display Buttons (R13.1), FanControl (17 pins)
GND: Display Buttons (R12.1 R13.2), FanControl (7 pins)
NetR3_1: Cypress (U1.68), Display Buttons (R3.1)
NetR4_1: Cypress (U1.1), Display Buttons (R4.1)
NetR5_1: Cypress (U1.66), Display Buttons (R5.1)
NetR6_1: Cypress (U1.62), Display Buttons (R6.1)
NetR7_1: Cypress (U1.63), Display Buttons (R7.1)
NetR8_1: Cypress (U1.64), Display Buttons (R8.1)
NetR9_1: Cypress (U1.65), Display Buttons (R9.1)
NetR11_1: Cypress (U1.2), Display Buttons (R11.1)
NetR28_1: Cypress (U1.31), FanControl (R28.1)
NetR30_1: Cypress (U1.32), FanControl (R30.1)
NetR31_1: Cypress (U1.48), Display Buttons (R31.1)
NetR32_1: Cypress (U1.49), Display Buttons (R32.1)
NetR33_1: Cypress (U1.50), Display Buttons (R33.1)
NetR34_1: Cypress (U1.51), Display Buttons (R34.1)
NetU1_29: Cypress (U1.29), FanControl (U2.6 U2.7)
NetU1_30: Cypress (U1.30), FanControl (U2.3)